# Altium schematic sheet MB_RELAY.SchDoc
size A4
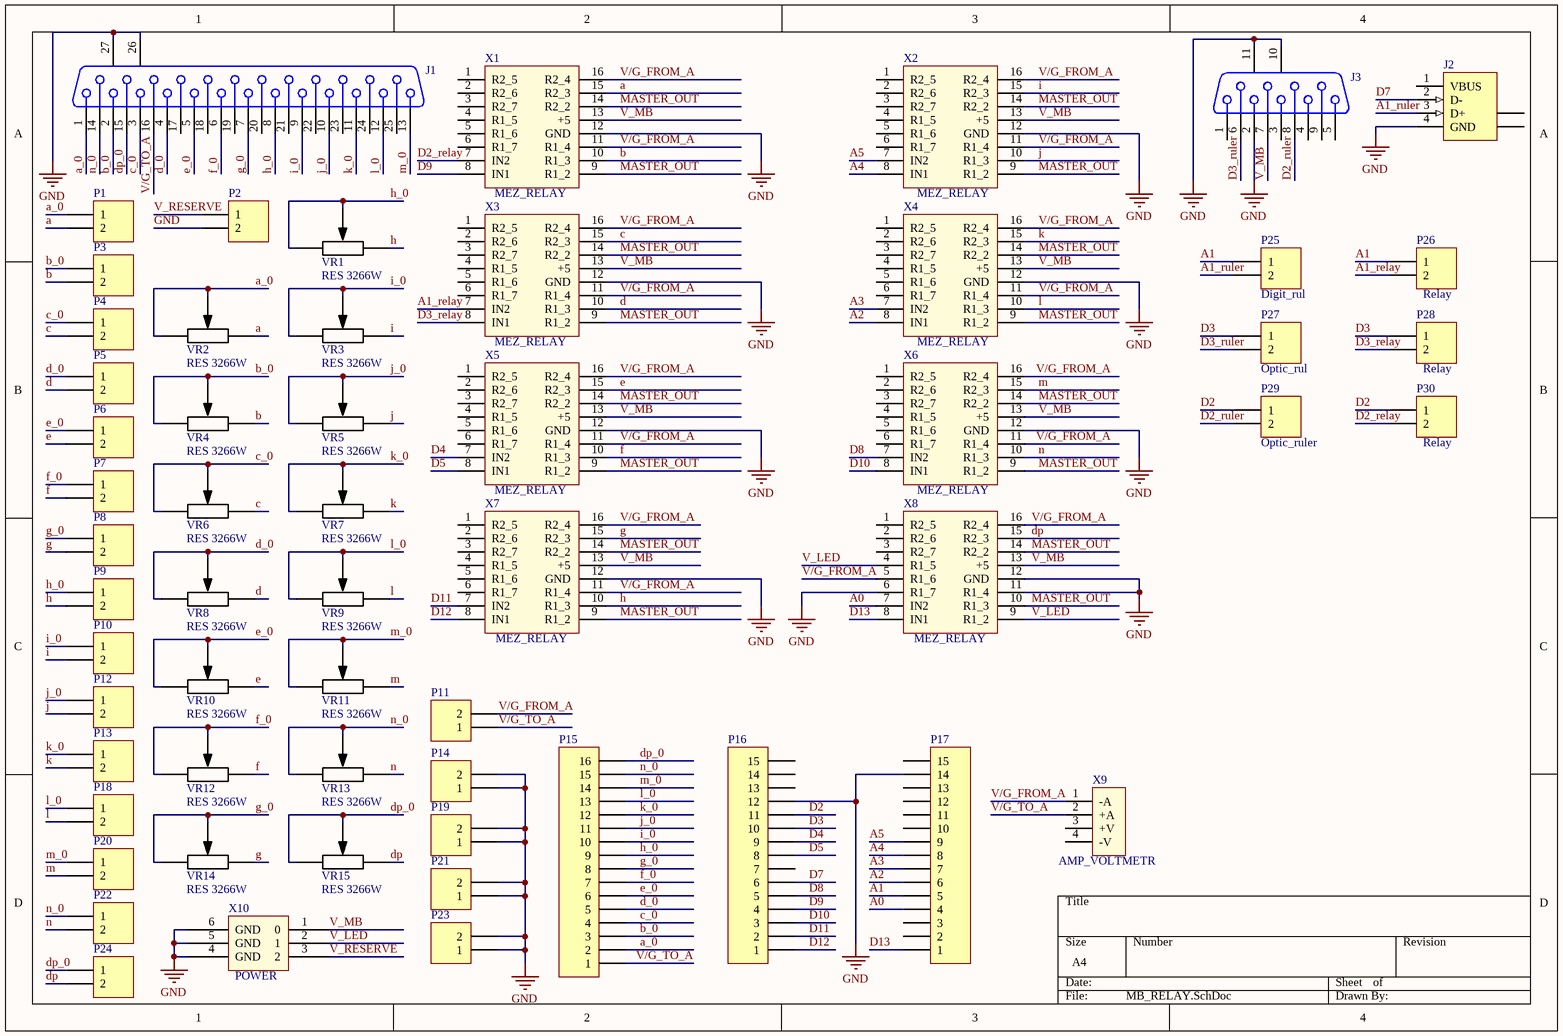
[diagram p0: MB_RELAY.SchDoc]

## Parts
J1  D Connector 25  [DSUB1.385-2H25A]  (value not drawn)
J2  1-353576-1  [353576]  (value not drawn)
J3  D Connector 9  [DSUB1.385-2H9]  (value not drawn)
P1  Header 2  [HDR1X2]  (value not drawn)
P2  Header 2  [HDR1X2]  (value not drawn)
P3  Header 2  [HDR1X2]  (value not drawn)
P4  Header 2  [HDR1X2]  (value not drawn)
P5  Header 2  [HDR1X2]  (value not drawn)
P6  GND  [HDR1X2]  (value not drawn)
P7  GND  [HDR1X2]  (value not drawn)
P8  GND  [HDR1X2]  (value not drawn)
P9  GND  [HDR1X2]  (value not drawn)
P10  Header 2  [HDR1X2]  (value not drawn)
P11  Header 2  [HDR1X2]  (value not drawn)
P12  Header 2  [HDR1X2]  (value not drawn)
P13  GND  [HDR1X2]  (value not drawn)
P14  GND  [HDR1X2]  (value not drawn)
P15  Header 16  [HDR1X16]  (value not drawn)
P16  Header 15  [HDR1X15]  (value not drawn)
P17  Header 15  [HDR1X15]  (value not drawn)
P18  GND  [HDR1X2]  (value not drawn)
P19  GND  [HDR1X2]  (value not drawn)
P20  GND  [HDR1X2]  (value not drawn)
P21  GND  [HDR1X2]  (value not drawn)
P22  GND  [HDR1X2]  (value not drawn)
P23  GND  [HDR1X2]  (value not drawn)
P24  GND  [HDR1X2]  (value not drawn)
P25  Digit_rul  [HDR1X2]
P26  Relay  [HDR1X2]
P27  Optic_rul  [HDR1X2]
P28  Relay  [HDR1X2]
P29  Optic_ruler  [HDR1X2]
P30  Relay  [HDR1X2]
VR1  RES 3266W  [RES 3266W]
VR2  RES 3266W  [RES 3266W]
VR3  RES 3266W  [RES 3266W]
VR4  RES 3266W  [RES 3266W]
VR5  RES 3266W  [RES 3266W]
VR6  RES 3266W  [RES 3266W]
VR7  RES 3266W  [RES 3266W]
VR8  RES 3266W  [RES 3266W]
VR9  RES 3266W  [RES 3266W]
VR10  RES 3266W  [RES 3266W]
VR11  RES 3266W  [RES 3266W]
VR12  RES 3266W  [RES 3266W]
VR13  RES 3266W  [RES 3266W]
VR14  RES 3266W  [RES 3266W]
VR15  RES 3266W  [RES 3266W]
X1  MEZ_RELAY  [MEZ_RELAY]
X2  MEZ_RELAY  [MEZ_RELAY]
X3  MEZ_RELAY  [MEZ_RELAY]
X4  MEZ_RELAY  [MEZ_RELAY]
X5  MEZ_RELAY  [MEZ_RELAY]
X6  MEZ_RELAY  [MEZ_RELAY]
X7  MEZ_RELAY  [MEZ_RELAY]
X8  MEZ_RELAY  [MEZ_RELAY]
X9  AMP_VOLTMETR  [AMP_VOLTMETER]
X10  POWER  [POWER]

## Nets
GND: J1.26(MH1) J1.27(MH2) J2.4(GND) J3.2 J3.10(MH1) J3.11(MH2) P2.2 P14.1 P14.2 P16.12 P17.14 P19.1 P19.2 P21.1 P21.2 P23.1 P23.2 X1.12(GND) X2.12(GND) X3.12(GND) X4.12(GND) X5.12(GND) X6.12(GND) X7.12(GND) X8.6(R1_7) X8.11(R1_4) X8.12(GND) X10.4(GND) X10.5(GND) X10.6(GND)
a: P1.2 VR2.3 X1.15(R2_3)
A0: P17.4 X8.7(IN2)
A1: P17.5 P25.1 P26.1
A1_relay: P26.2 X3.7(IN2)
A1_ruler: J2.3(D+) P25.2
A2: P17.6 X4.8(IN1)
A3: P17.7 X4.7(IN2)
A4: P17.8 X2.8(IN1)
A5: P17.9 X2.7(IN2)
a_0: J1.1 P1.1 P15.2 VR2.1 VR2.2
b: P3.2 VR4.3 X1.10(R1_3)
b_0: J1.2 P3.1 P15.3 VR4.1 VR4.2
c: P4.2 VR6.3 X3.15(R2_3)
c_0: J1.3 P4.1 P15.4 VR6.1 VR6.2
d: P5.2 VR8.3 X3.10(R1_3)
D2: P16.11 P29.1 P30.1
D2_relay: P30.2 X1.7(IN2)
D2_ruler: J3.8 P29.2
D3: P16.10 P27.1 P28.1
D3_relay: P28.2 X3.8(IN1)
D3_ruler: J3.6 P27.2
D4: P16.9 X5.7(IN2)
D5: P16.8 X5.8(IN1)
D7: J2.2(D-) P16.6
D8: P16.5 X6.7(IN2)
D9: P16.4 X1.8(IN1)
D10: P16.3 X6.8(IN1)
D11: P16.2 X7.7(IN2)
D12: P16.1 X7.8(IN1)
D13: P17.1 X8.8(IN1)
d_0: J1.4 P5.1 P15.5 VR8.1 VR8.2
dp: P24.2 VR15.3 X8.15(R2_3)
dp_0: J1.15 P15.16 P24.1 VR15.1 VR15.2
e: P6.2 VR10.3 X5.15(R2_3)
e_0: J1.5 P6.1 P15.6 VR10.1 VR10.2
f: P7.2 VR12.3 X5.10(R1_3)
f_0: J1.6 P7.1 P15.7 VR12.1 VR12.2
g: P8.2 VR14.3 X7.15(R2_3)
g_0: J1.7 P8.1 P15.8 VR14.1 VR14.2
h: P9.2 VR1.3 X7.10(R1_3)
h_0: J1.8 P9.1 P15.9 VR1.1 VR1.2
i: P10.2 VR3.3 X2.15(R2_3)
i_0: J1.9 P10.1 P15.10 VR3.1 VR3.2
j: P12.2 VR5.3 X2.10(R1_3)
j_0: J1.10 P12.1 P15.11 VR5.1 VR5.2
k: P13.2 VR7.3 X4.15(R2_3)
k_0: J1.11 P13.1 P15.12 VR7.1 VR7.2
l: P18.2 VR9.3 X4.10(R1_3)
l_0: J1.12 P15.13 P18.1 VR9.1 VR9.2
m: P20.2 VR11.3 X6.15(R2_3)
m_0: J1.13 P15.14 P20.1 VR11.1 VR11.2
MASTER_OUT: X1.9(R1_2) X1.14(R2_2) X2.9(R1_2) X2.14(R2_2) X3.9(R1_2) X3.14(R2_2) X4.9(R1_2) X4.14(R2_2) X5.9(R1_2) X5.14(R2_2) X6.9(R1_2) X6.14(R2_2) X7.9(R1_2) X7.14(R2_2) X8.10(R1_3) X8.14(R2_2)
n: P22.2 VR13.3 X6.10(R1_3)
n_0: J1.14 P15.15 P22.1 VR13.1 VR13.2
V/G_FROM_A: P11.2 X1.11(R1_4) X1.16(R2_4) X2.11(R1_4) X2.16(R2_4) X3.11(R1_4) X3.16(R2_4) X4.11(R1_4) X4.16(R2_4) X5.11(R1_4) X5.16(R2_4) X6.11(R1_4) X6.16(R2_4) X7.11(R1_4) X7.16(R2_4) X8.5(R1_6) X8.16(R2_4) X9.1(-A)
V/G_TO_A: J1.16 P11.1 P15.1 X9.2(+A)
V_LED: X8.4(R1_5) X8.9(R1_2) X10.2(1)
V_MB: J3.7 X1.13(+5) X2.13(+5) X3.13(+5) X4.13(+5) X5.13(+5) X6.13(+5) X7.13(+5) X8.13(+5) X10.1(0)
V_RESERVE: P2.1 X10.3(2)

Not connected (* = marked no-connect by the designer): J1 17 18 19 20 21 22 23 24 25; J2 1(VBUS) 5(SHLD) 6(SHLD); J3 1 3 4 5 9; P16 7 13 14 15; P17 2 3 10 11 12 13 15; X1 1(R2_5) 2(R2_6) 3(R2_7) 4(R1_5) 5(R1_6) 6(R1_7); X2 1(R2_5) 2(R2_6) 3(R2_7) 4(R1_5) 5(R1_6) 6(R1_7); X3 1(R2_5) 2(R2_6) 3(R2_7) 4(R1_5) 5(R1_6) 6(R1_7); X4 1(R2_5) 2(R2_6) 3(R2_7) 4(R1_5) 5(R1_6) 6(R1_7); X5 1(R2_5) 2(R2_6) 3(R2_7) 4(R1_5) 5(R1_6) 6(R1_7); X6 1(R2_5) 2(R2_6) 3(R2_7) 4(R1_5) 5(R1_6) 6(R1_7); X7 1(R2_5) 2(R2_6) 3(R2_7) 4(R1_5) 5(R1_6) 6(R1_7); X8 1(R2_5) 2(R2_6) 3(R2_7); X9 3(+V) 4(-V)

## Library data of the parts
J1 = D Connector 25: Receptacle Assembly, 25 Position, Right Angle; PackageDocument: U; Positions: 25; Published: 15-Jun-2001; LatestRevisionDate: 17-Jul-2002; LatestRevisionNote: Re-released for DXP Platform.; DatasheetDocument: 19-Mar-1999; PackageReference: 787202; Publisher: Altium Limited; Orientation: Right Angle; Gender: Receptacle
J2 = 1-353576-1: USB 1.1, Right Angle, SMT, A Type, Receptacle, 4 Position, White; ContactMaterial: Copper Alloy; ContactPlating: Gold over Palladium Nickel; PCB_Layout: Complies with manufacturer's recommendation.; DrillSize: Corresponds to nominal value.; PanelGround: Without; Published: 15-Jul-2004; DatasheetDocument: 11-Apr-2003; PackageDocument: 11-Apr-2003; PackageReference: 353576; Publisher: Altium Limited; HousingMaterial: Thermoplastic; ComponentLink1Description: Manufacturer Link; ComponentLink1URL: http://www.tycoelectronics.com/; ComponentLink2Description: Packaging Specification; ComponentLink2URL: http://ecommas.tycoelectronics.com/commerce/DocumentDelivery/DDEController?Action=showdoc&DocId=Customer+Drawing%7F353576%7FD%7Ftif%7FJapanese%7FJPN_CD_353576_D.tif
J3 = D Connector 9: Receptacle Assembly, 9 Position, Right Angle; PackageDocument: O; Positions: 9; Published: 15-Jun-2001; LatestRevisionDate: 17-Jul-2002; LatestRevisionNote: Re-released for DXP Platform.; DatasheetDocument: 1-Sep-1999; PackageReference: 788750; Publisher: Altium Limited; Orientation: Right Angle; Gender: Receptacle
P1-P14 P18-P30 = Header 2: Header, 2-Pin; LatestRevisionDate: 17-Jul-2002; LatestRevisionNote: Re-released for DXP Platform.; Publisher: Altium Limited
P15 = Header 16: Header, 16-Pin; LatestRevisionDate: 17-Jul-2002; LatestRevisionNote: Re-released for DXP Platform.; Publisher: Altium Limited
P16 P17 = Header 15: Header, 15-Pin; LatestRevisionDate: 17-Jul-2002; LatestRevisionNote: Re-released for DXP Platform.; Publisher: Altium Limited